# EAGLE design 555_astable_multivibrator (EAGLE 9.6.2)
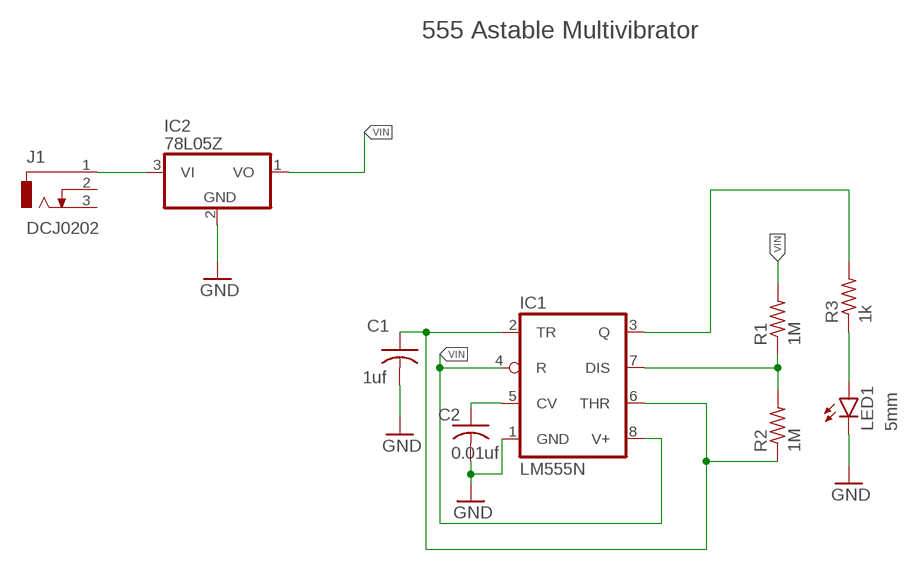
[diagram p0: schematic, sheet 1]

## Parts
C1  1uf  C-US050-024X044  [C050-024X044]
C2  0.01uf  C-US050-024X044  [C050-024X044]
IC1  LM555N  [DIL08]
IC2  78L05Z  [TO92]
J1  DCJ0202  [DCJ0202]
LED1  5mm  LED5MM  [LED5MM]
R1  1M  R-US_0207/2V  [0207/2V]
R2  1M  R-US_0207/2V  [0207/2V]
R3  1k  R-US_0207/2V  [0207/2V]

## Nets
5V: C1.1 IC1.2(TR) IC1.6(THR) R2.1
GND: C1.2 C2.2 IC1.1(GND) IC2.2(GND) LED1.K(C)
N$1: IC1.7(DIS) R1.1 R2.2
N$2: IC2.3(VI) J1.1
N$3: C2.1 IC1.5(CV)
N$4: IC1.3(Q) R3.2
N$5: LED1.A R3.1
VIN: IC1.4(R) IC1.8(V+) IC2.1(VO) R1.2
Unconnected: J1.2 J1.3

## Notes on the sheet
- 555 Astable Multivibrator

## Library data of the parts
C1 C2 = rcl:C-US: CAPACITOR, American symbol; SPICEPREFIX: C
IC1 = linear:*555: TIMER
IC2 = linear:78*: Positive VOLTAGE REGULATOR Source: http://cache.national.com/ds/LM/LM78L05.pdf http://www.fairchildsemi.com/ds/LM/LM7805.pdf
J1 = con-jack:DCJ0202: DC POWER JACK Source: DCJ0202.pdf; OC_FARNELL: unknown; OC_NEWARK: unknown
LED1 = led:LED: LED OSRAM: - CHIPLED LG R971, LG N971, LY N971, LG Q971, LY Q971, LO R971, LY R971 LH N974, LH R974 LS Q976, LO Q976, LY Q976 LO Q996 - Hyper CHIPLED LW Q18S LB Q993, LB Q99A, LB R99A - SideLED LS A670, LO A670, LY A670, LG A670, LP A670 LB A673, LV A673, LT A673, LW A673 LH A674 LY A675 LS A676, LA A676, LO A676, LY A676, LW A676 LS A679, LY A679, LG A679 - Hyper Micro SIDELED® LS Y876, LA Y876, LO Y876, LY Y876 LT Y87S - SmartLED LW L88C, LW L88S LB L89C, LB L89S, LG L890 LS L89K, LO L89K, LY L89K LS L896, LA L896, LO L896, LY L896 - TOPLED LS T670, LO T670, LY T670, LG T670, LP T670 LSG T670, LSP T670, LSY T670, LOP T670, LYG T670 LG T671, LOG T671, LSG T671 LB T673, LV T673, LT T673, LW T673 LH T674 LS T676, LA T676, LO T676, LY T676, LB T676, LH T676, LSB T676, LW T676 LB T67C, LV T67C, LT T67C, LS T67K, LO T67K, LY T67K, LW E67C LS E67B, LA E67B, LO E67B, LY E67B, LB E67C, LV E67C, LT E67C LW T67C LS T679, LY T679, LG T679 LS T770, LO T770, LY T770, LG T770, LP T770 LB T773, LV T773, LT T773, LW T773 LH T774 LS E675, LA E675, LY E675, LS T675 LS T776, LA T776, LO T776, LY T776, LB T776 LHGB T686 LT T68C, LB T68C - Hyper Mini TOPLED® LB M676 - Mini TOPLED Santana® LG M470 LS M47K, LO M47K, LY M47K Source: http://www.osram.convergy.de LUXEON: - LUMILED® LXK2-PW12-R00, LXK2-PW12-S00, LXK2-PW14-U00, LXK2-PW14-V00 LXK2-PM12-R00, LXK2-PM12-S00, LXK2-PM14-U00 LXK2-PE12-Q00, LXK2-PE12-R00, LXK2-PE12-S00, LXK2-PE14-T00, LXK2-PE14-U00 LXK2-PB12-K00, LXK2-PB12-L00, LXK2-PB12-M00, LXK2-PB14-N00, LXK2-PB14-P00, LXK2-PB14-Q00 LXK2-PR12-L00, LXK2-PR12-M00, LXK2-PR14-Q00, LXK2-PR14-R00 LXK2-PD12-Q00, LXK2-PD12-R00, LXK2-PD12-S00 LXK2-PH12-R00, LXK2-PH12-S00 LXK2-PL12-P00, LXK2-PL12-Q00, LXK2-PL12-R00 Source: www.luxeon.com KINGBRIGHT: KA-3528ASYC Source: www.kingbright.com
R1-R3 = rcl:R-US_: RESISTOR, American symbol; SPICEPREFIX: R

## Board
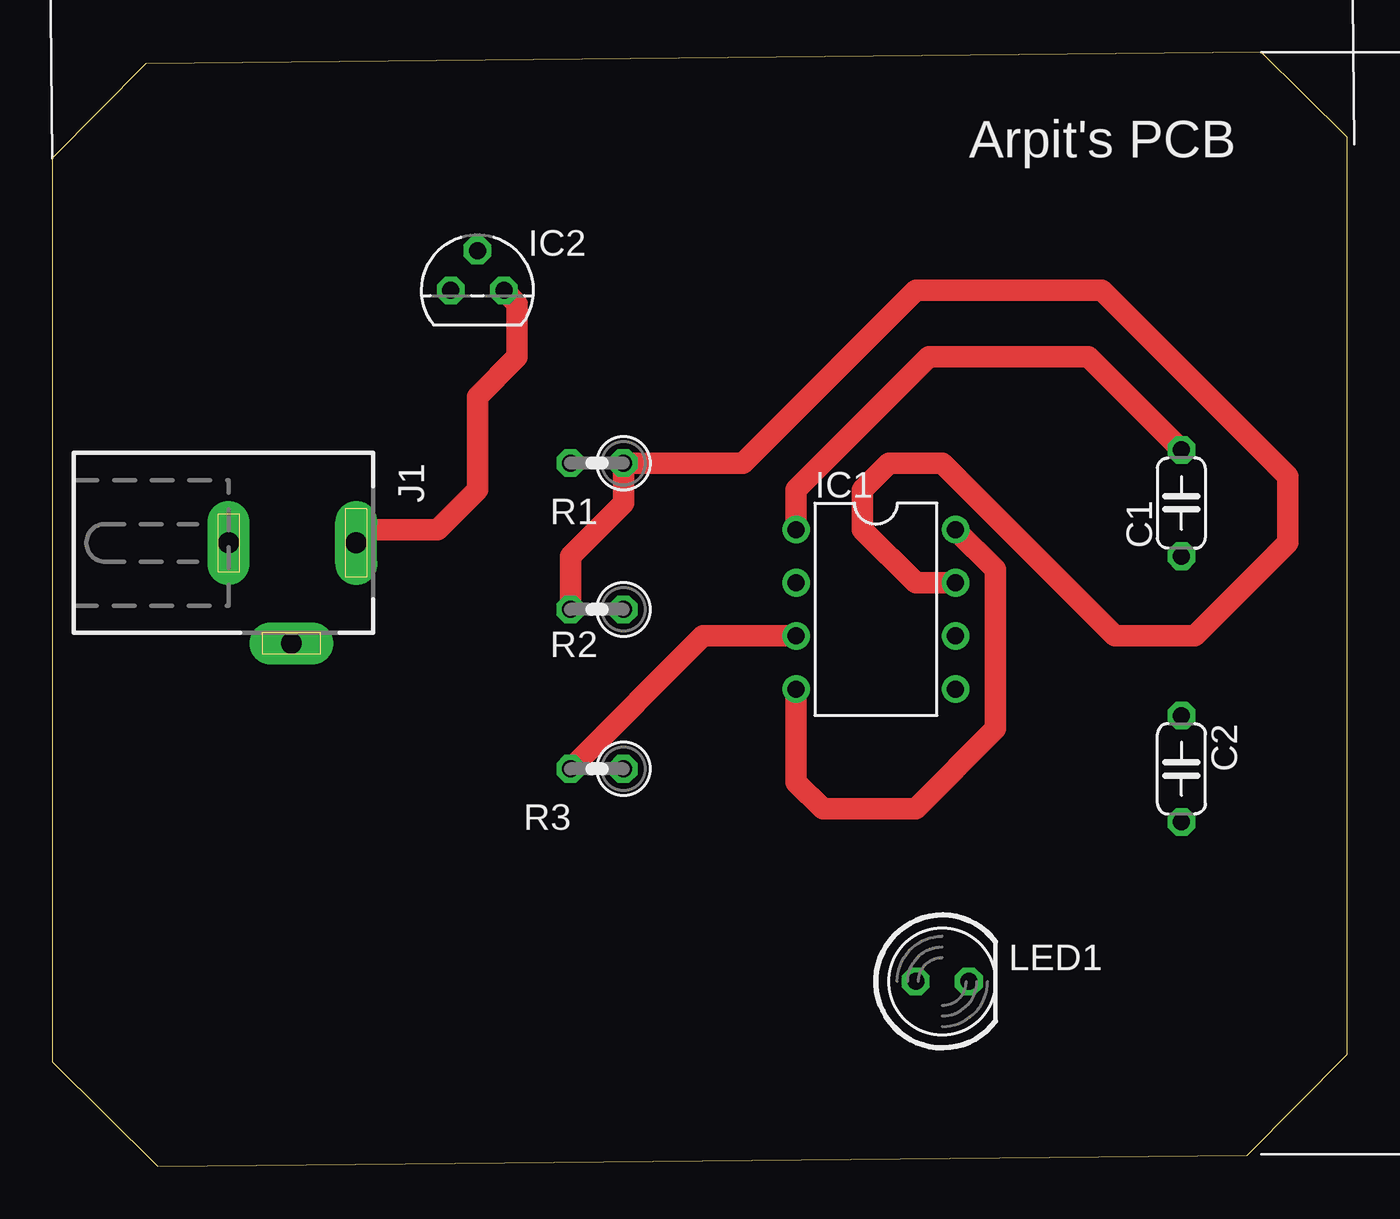
[diagram p1: board, top side]
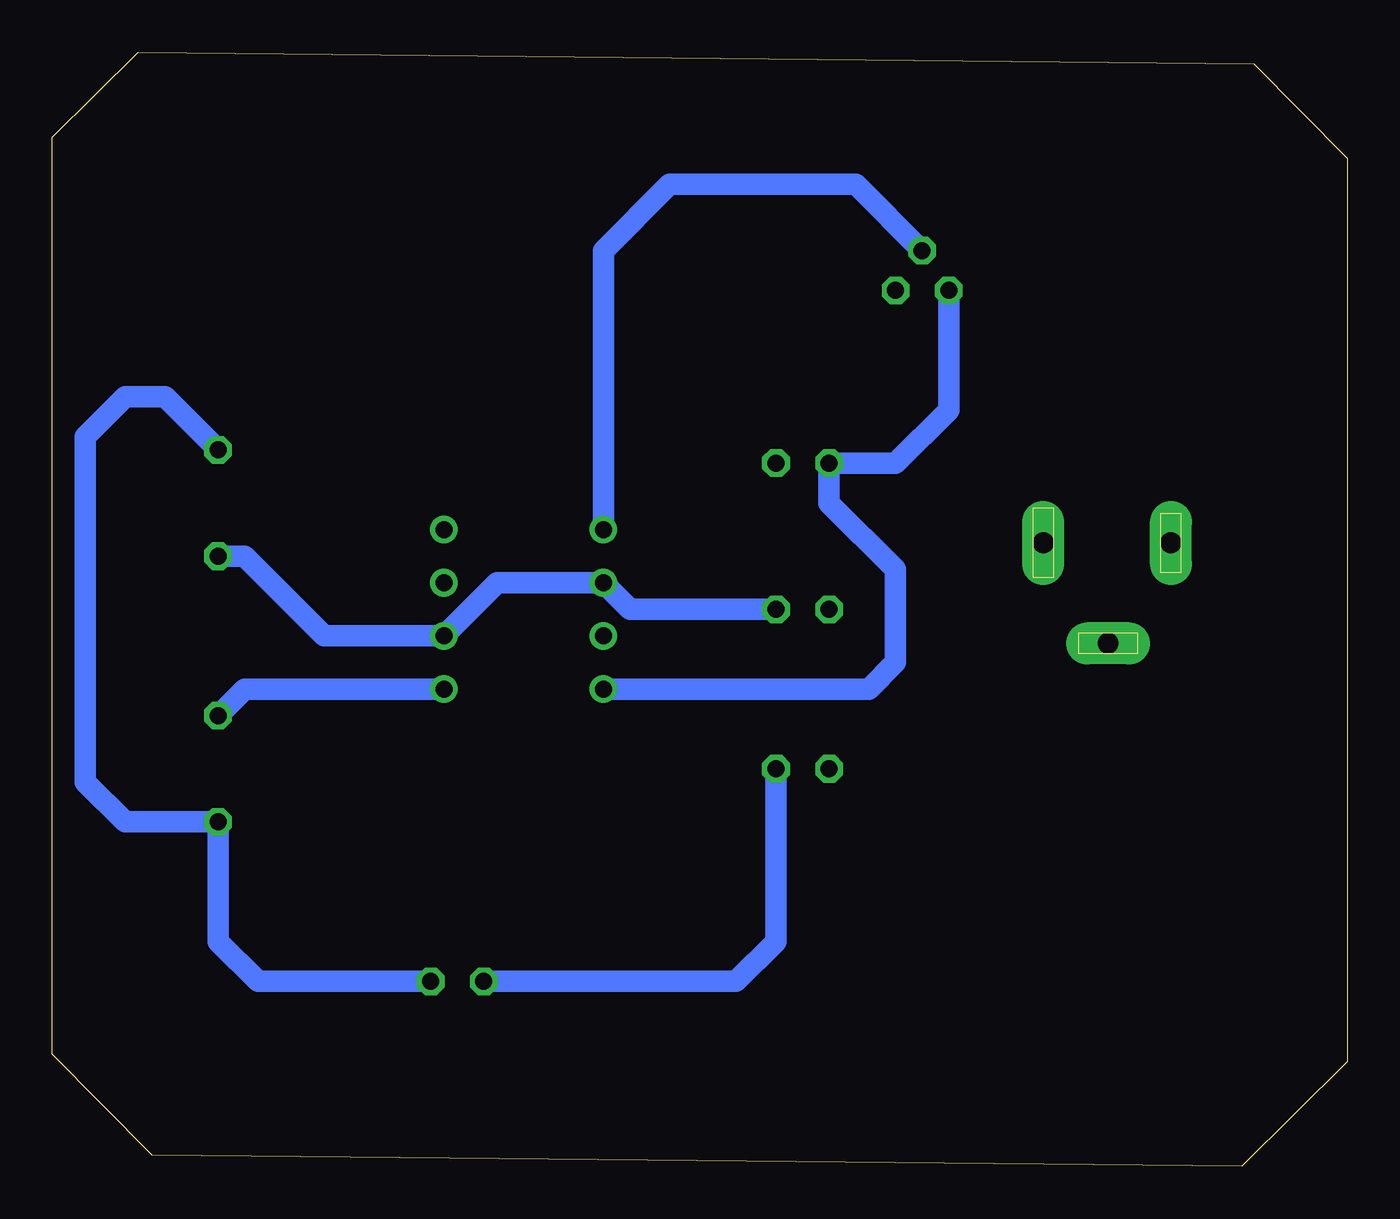
[diagram p2: board, bottom side, seen from below]

Size 61.9 x 53.24 mm. Coordinates in mm from the lower left corner, seen from the top.
Outline: 0,48.18 0,4.99 5.04,0 57.12,0.53 61.9,5.36 61.9,49.18 57.8,53.24 4.47,52.69 0,48.18
Copper layers (1*16): Top 0.035mm / dielectric 1.5mm / Bottom 0.035mm
Design rules "default *": minimum track width 6mil, minimum drill 0.35mm, track to track 8mil, track to pad 8mil, pad to pad 8mil, via to via 8mil, smd to smd 6mil, copper to edge 40mil, drill to drill 6mil, minimum pad ring 10mil, minimum via ring 8mil, stop-mask expansion 4mil, vias tented up to drill 0mil, thermal gap 10mil

### Footprints (pad centres in the part's own frame; a part is rotated, then mirrored left to right if it is on the bottom)
C050-024X044 = drill 0.813 octagon: 1 -2.54,0; 2 2.54,0
DIL08 = drill 0.813 pad 1.27: 1 -3.81,-3.81; 2 -1.27,-3.81; 3 1.27,-3.81; 4 3.81,-3.81; 5 3.81,3.81; 6 1.27,3.81; 7 -1.27,3.81; 8 -3.81,3.81
TO92 = drill 0.813 octagon: 1 -1.27,0; 2 0,1.905; 3 1.27,0
DCJ0202 = drill 1 pad 2 long: 1 0,3.1; 2 4.8,0; 3 0,-3
LED5MM = drill 0.813 octagon: A -1.27,0; K 1.27,0
0207/2V = drill 0.813 octagon: 1 -1.27,0; 2 1.27,0

### Placement (x,y rotation side)
C1  53.98,31.7 90 top
C2  53.98,19 270 top
IC1  39.37,26.62 270 top
IC2  20.32,41.86 0 top
J1  11.43,29.79 270 top
LED1  42.55,8.84 0 top
R1  26.04,33.6 180 top
R2  26.04,26.62 180 top
R3  26.04,19 180 top

### Tracks (layer width: path | path; a pad name or v marks a point on that pad's centre or on a via)
5V
  Bottom 1.016: R2.1 34.29,26.62 IC1.2 40.64,27.89 IC1.6 48.9,25.35 52.7,29.16 C1.1
GND
  Top 1.016: C1.2 49.53,38.68 41.91,38.68 35.56,32.33 IC1.1
  Bottom 1.016: IC2.2 23.5,46.94 32.38,46.94 35.56,43.76 IC1.1 | LED1.K 52.07,8.84 53.98,10.74 C2.2 58.42,16.46 60.33,18.36 60.33,34.87 58.42,36.78 56.52,36.78 C1.2
N$1
  Top 1.016: R2.2 24.77,29.16 27.3,31.7 R1.1 33.02,33.6 41.27,41.86 50.16,41.86 59.05,32.97 59.05,29.79 54.61,25.35 50.8,25.35 42.55,33.6 40.01,33.6 38.73,32.33 38.73,30.43 41.27,27.89 IC1.7
N$2
  Top 1.016: J1.1 15.16,30.43 18.41,30.43 20.32,32.33 20.32,36.78 22.23,38.68 22.23,41.22 IC2.3
N$3
  Bottom 1.016: IC1.5 52.7,22.81 C2.1
N$4
  Top 1.016: R3.2 31.11,25.35 IC1.3
N$5
  Bottom 1.016: R3.1 27.3,10.74 29.21,8.84 LED1.A
VIN
  Top 1.016: IC1.8 45.09,28.52 45.09,20.9 41.27,17.09 36.83,17.09 35.56,18.36 IC1.4
  Bottom 1.016: IC2.1 19.05,36.14 21.59,33.6 R1.2 24.77,31.7 21.59,28.52 21.59,24.08 22.86,22.81 IC1.4

### Text on the board
tNames: Arpit's PCB